# EAGLE schematic mapleCUx_med_022 (EAGLE 7.3.0)
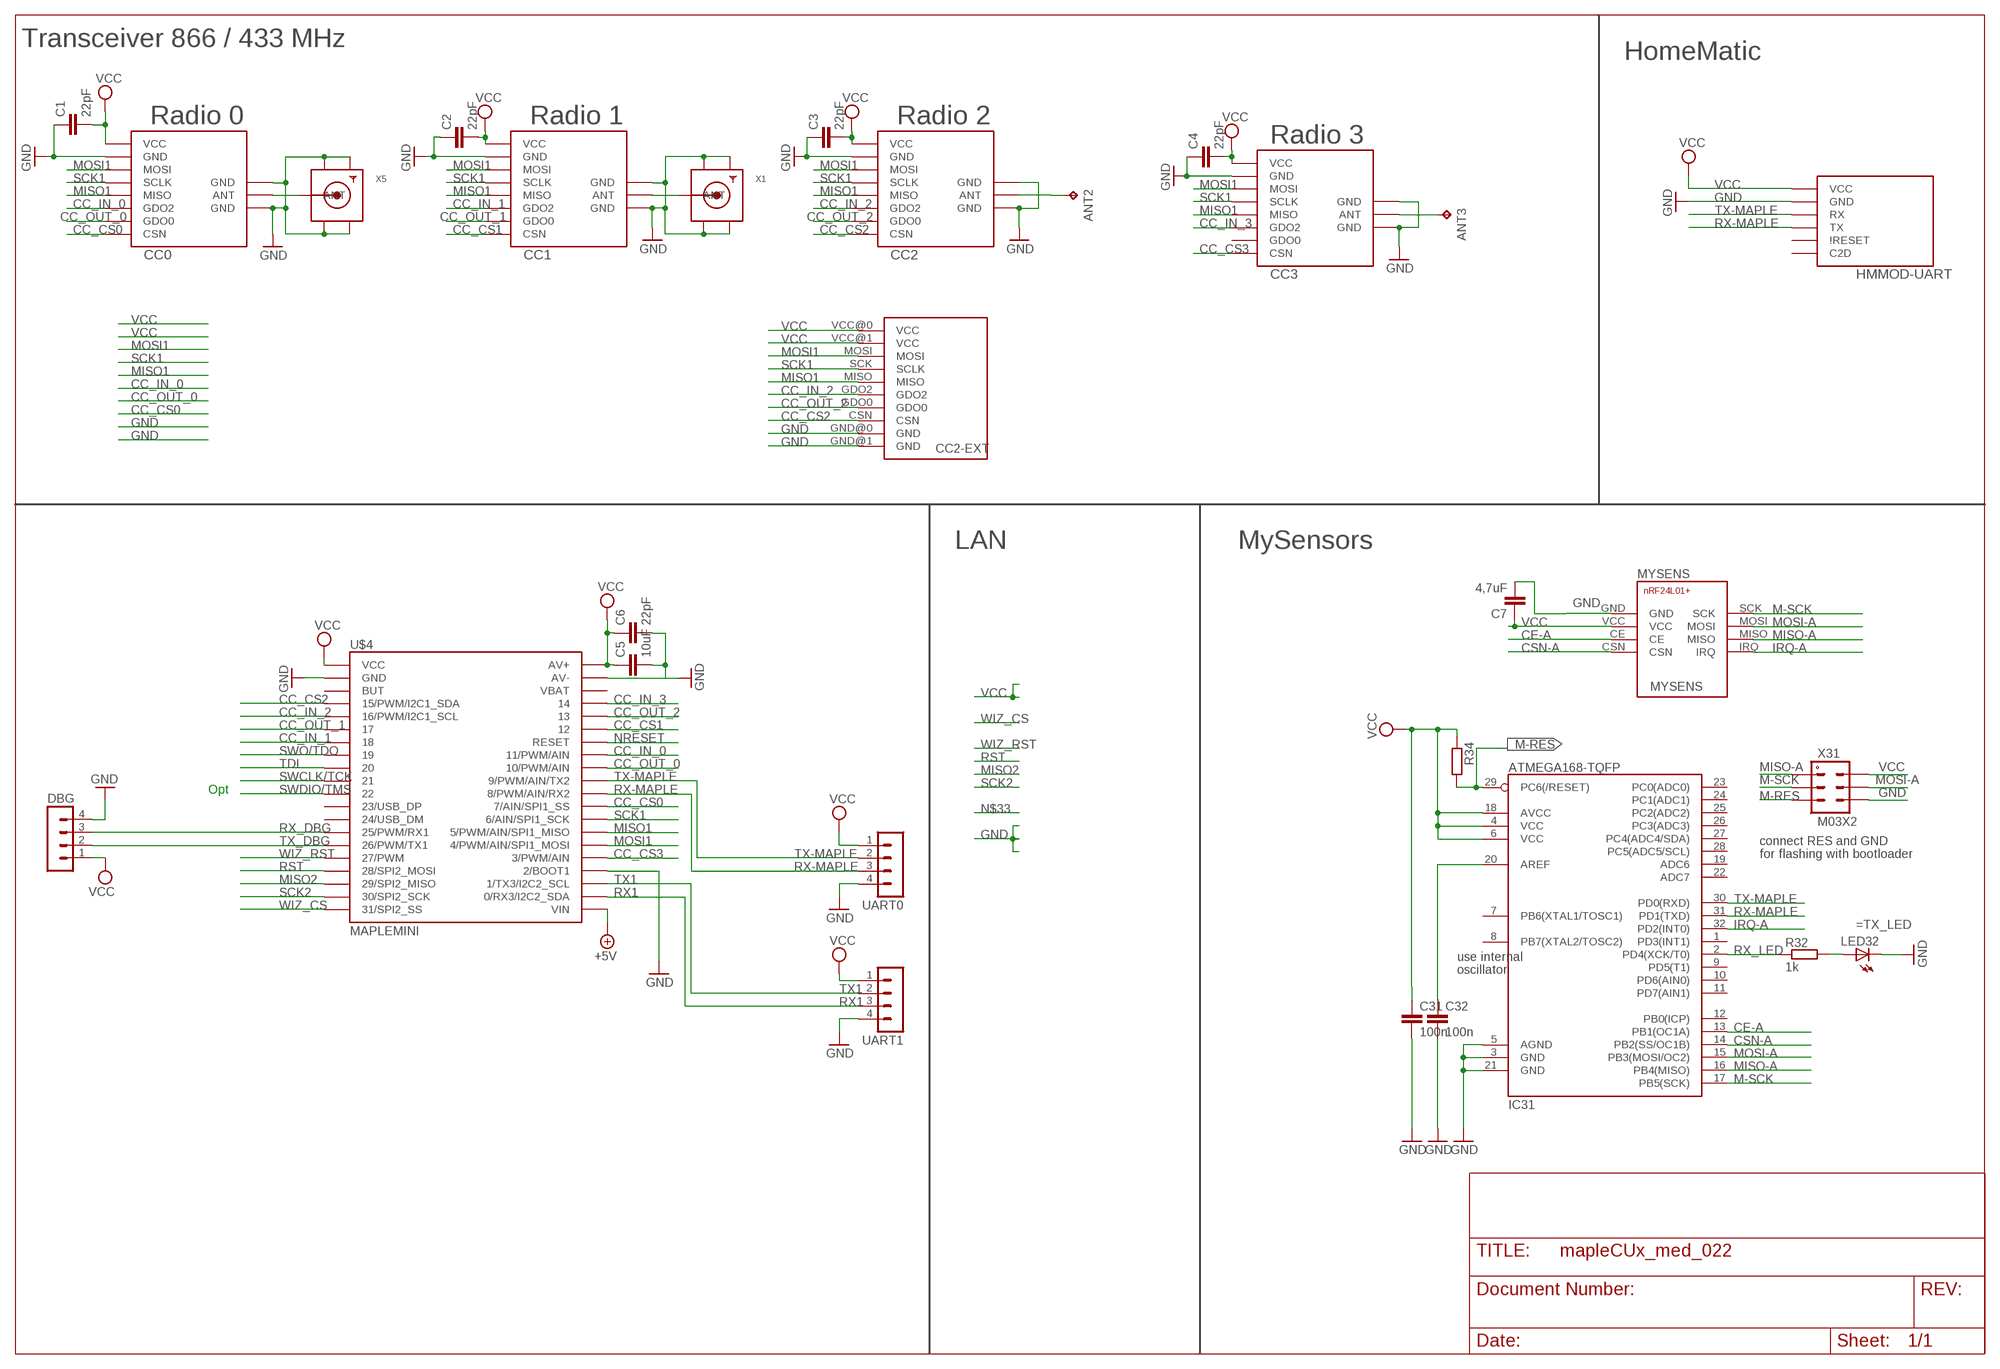
[diagram p0: schematic, sheet 1]

## Parts
ANT2  TPPAD1-13  [P1-13]
ANT3  TPPAD1-13  [P1-13]
C1  22pF  C-EUC0805  [C0805]
C2  22pF  C-EUC0805  [C0805]
C3  22pF  C-EUC0805  [C0805]
C4  22pF  C-EUC0805  [C0805]
C5  10uF  C-EUC1210  [C1210]
C6  22pF  C-EUC0805  [C0805]
C7  4,7uF  C-EUC1210  [C1210]
C31  100n  C-EUC0805  [C0805]
C32  100n  C-EUC0805  [C0805]
CC0  CC1101  CC1101_MODULE1SMD  [CC1101_MODULE1_SMD]
CC1  CC1101_MODULE1SMD  [CC1101_MODULE1_SMD]
CC2  CC1101_MODULE1SMD  [CC1101_MODULE1_SMD]
CC2-EXT  CC1101_MODULE3_DIL  [CC1101_MODULE3_DIL]
CC3  CC1101_MODULE1SMD  [CC1101_MODULE1_SMD]
DBG  MA04-1  [MA04-1]
HMMOD-UART  HM-MOD-UARTDIL  [HM-MOD-UART-DIL]
IC31  ATMEGA168-TQFP  [TQFP32-08]
LED32  LEDCHIPLED_0805  [CHIPLED_0805]
MYSENS  NRF24L01+SMD  [NRF24L01+SMD]
R32  1k  R-EU_R0805  [R0805]
R34  R-EU_R0805  [R0805]
U$4  MAPLEMINI  [20-DIP]
UART0  MA04-1  [MA04-1]
UART1  MA04-1  [MA04-1]
X1  SMACONNECTOR_EDGE_UFL  [SMA_EDGELAUNCH_UFL]
X5  SMACONNECTOR_EDGE_UFL  [SMA_EDGELAUNCH_UFL]
X31  M03X2  [2X03-1.27MM_SMD]

## Nets
+5V: U$4.21(VIN)
CC_CS0: CC0.CSN U$4.29(7/AIN/SPI1_SS)
CC_CS1: CC1.CSN U$4.35
CC_CS2: CC2-EXT.CSN CC2.CSN U$4.4(15/PWM/I2C1_SDA)
CC_CS3: CC3.CSN U$4.25(3/PWM/AIN)
CC_IN_0: CC0.GDO2 U$4.33(11/PWM/AIN)
CC_IN_1: CC1.GDO2 U$4.7
CC_IN_2: CC2-EXT.GDO2 CC2.GDO2 U$4.5(16/PWM/I2C1_SCL)
CC_IN_3: CC3.GDO2 U$4.37
CC_OUT_0: CC0.GDO0 U$4.32(10/PWM/AIN)
CC_OUT_1: CC1.GDO0 U$4.6
CC_OUT_2: CC2-EXT.GDO0 CC2.GDO0 U$4.36
CE-A: IC31.13(PB1(OC1A)) MYSENS.CE
CSN-A: IC31.14(PB2(SS/OC1B)) MYSENS.CSN
GND [PWR]: C1.1 C2.1 C3.1 C4.1 C5.2 C6.2 C7.2 C31.2 C32.2 CC0.GND@0(GND) CC0.GND@1(GND) CC0.GND@2(GND) CC1.GND@0(GND) CC1.GND@1(GND) CC1.GND@2(GND) CC2-EXT.GND@0(GND) CC2-EXT.GND@1(GND) CC2.GND@0(GND) CC2.GND@1(GND) CC2.GND@2(GND) CC3.GND@0(GND) CC3.GND@1(GND) CC3.GND@2(GND) DBG.4 HMMOD-UART.2(GND) IC31.3(GND) IC31.5(AGND) IC31.21(GND) LED32.C MYSENS.GND U$4.2(GND) U$4.24(2/BOOT1) U$4.39(AV-) UART0.4 UART1.4 X1.GND@1(GND1) X1.GND@2(GND2) X1.GND@3(GND3) X1.GND@4(GND4) X5.GND@1(GND1) X5.GND@2(GND2) X5.GND@3(GND3) X5.GND@4(GND4) X31.P$6
IRQ-A: IC31.32(PD2(INT0)) MYSENS.IRQ
M-RES: IC31.29(PC6(/RESET)) R34.2 X31.P$5
M-SCK: IC31.17(PB5(SCK)) MYSENS.SCK X31.P$3
MISO1: CC0.MISO CC1.MISO CC2-EXT.MISO CC2.MISO CC3.MISO U$4.27(5/PWM/AIN/SPI1_MISO)
MISO2: U$4.18(29/SPI2_MISO)
MISO-A: IC31.16(PB4(MISO)) MYSENS.MISO X31.P$1
MOSI1: CC0.MOSI CC1.MOSI CC2-EXT.MOSI CC2.MOSI CC3.MOSI U$4.26(4/PWM/AIN/SPI1_MOSI)
MOSI-A: IC31.15(PB3(MOSI/OC2)) MYSENS.MOSI X31.P$4
N$1: CC1.ANT X1.P(ANT)
N$2: ANT3.TP CC3.ANT
N$3: ANT2.TP CC2.ANT
N$4: CC0.ANT X5.P(ANT)
N$5: LED32.A R32.2
N$15: C32.1 IC31.20(AREF)
NRESET: U$4.34(RESET)
RST: U$4.17(28/SPI2_MOSI)
RX1: U$4.22(0/RX3/I2C2_SDA) UART1.3
RX-MAPLE: HMMOD-UART.5(TX) IC31.31(PD1(TXD)) U$4.30(8/PWM/AIN/RX2) UART0.3
RX_DBG: DBG.3 U$4.14(25/PWM/RX1)
RX_LED: IC31.2(PD4(XCK/T0)) R32.1
SCK1: CC0.SCLK CC1.SCLK CC2-EXT.SCK(SCLK) CC2.SCLK CC3.SCLK U$4.28(6/AIN/SPI1_SCK)
SCK2: U$4.19(30/SPI2_SCK)
SWCLK/TCK: U$4.10
SWDIO/TMS: U$4.11
SWO/TDO: U$4.8
TDI: U$4.9
TX1: U$4.23(1/TX3/I2C2_SCL) UART1.2
TX-MAPLE: HMMOD-UART.6(RX) IC31.30(PD0(RXD)) U$4.31(9/PWM/AIN/TX2) UART0.2
TX_DBG: DBG.2 U$4.15(26/PWM/TX1)
VCC [PWR]: C1.2 C2.2 C3.2 C4.2 C5.1 C6.1 C7.1 C31.1 CC0.VCC CC1.VCC CC2-EXT.VCC@0(VCC) CC2-EXT.VCC@1(VCC) CC2.VCC CC3.VCC DBG.1 HMMOD-UART.1(VCC) IC31.4(VCC) IC31.6(VCC) IC31.18(AVCC) MYSENS.VCC R34.1 U$4.1(VCC) U$4.40(AV+) UART0.1 UART1.1 X31.P$2
WIZ_CS: U$4.20(31/SPI2_SS)
WIZ_RST: U$4.16(27/PWM)
Unconnected: CC3.GDO0 HMMOD-UART.3(C2D) HMMOD-UART.4(\!RESET) IC31.1(PD3(INT1)) IC31.7(PB6(XTAL1/TOSC1)) IC31.8(PB7(XTAL2/TOSC2)) IC31.9(PD5(T1)) IC31.10(PD6(AIN0)) IC31.11(PD7(AIN1)) IC31.12(PB0(ICP)) IC31.19(ADC6) IC31.22(ADC7) IC31.23(PC0(ADC0)) IC31.24(PC1(ADC1)) IC31.25(PC2(ADC2)) IC31.26(PC3(ADC3)) IC31.27(PC4(ADC4/SDA)) IC31.28(PC5(ADC5/SCL)) U$4.3(BUT) U$4.12(23/USB_DP) U$4.13(24/USB_DM) U$4.38(VBAT)

## Notes on the sheet
- Transceiver 866 / 433 MHz
- HomeMatic
- Radio 0 | Radio 1 | Radio 2
- Radio 3
- LAN | MySensors
- Opt
- connect RES and GND
- for flashing with bootloader
- =TX_LED
- use internal
- oscillator

## Library data of the parts
ANT2 ANT3 = testpad:TP: Test pad
C1-C7 C31 C32 = rcl:C-EU: CAPACITOR, European symbol
CC0 CC1-CC3 = wireless:CC1101_MODULE1: CC1101 wireless module for 433/868 MHz (sold from Aliexpress). DIL version for mounting with pin header (and SMD soldering) and SMD only variant available.
CC2-EXT = wireless:CC1101_MODULE3_DIL: 433 Mhz CC1101 wireless module named RF1101SE V3.1 package special has only limited silk screen on tPlace layer
DBG UART0 UART1 = con-lstb:MA04-1: PIN HEADER; OC_FARNELL: unknown; OC_NEWARK: unknown
HMMOD-UART = wireless:HM-MOD-UART: eQ3 HM-MOD-UART-AW-SH2 wireless module for 868 MHz. DIL version for mounting with pin header (antenna upwards) and SMD variant available (antenna downwards).
IC31 = atmel:ATMEGA168: Atmel Atmega 168/328/328P
LED32 = led:LED: LED OSRAM: - CHIPLED LG R971, LG N971, LY N971, LG Q971, LY Q971, LO R971, LY R971 LH N974, LH R974 LS Q976, LO Q976, LY Q976 LO Q996 - Hyper CHIPLED LW Q18S LB Q993, LB Q99A, LB R99A - SideLED LS A670, LO A670, LY A670, LG A670, LP A670 LB A673, LV A673, LT A673, LW A673 LH A674 LY A675 LS A676, LA A676, LO A676, LY A676, LW A676 LS A679, LY A679, LG A679 - Hyper Micro SIDELED® LS Y876, LA Y876, LO Y876, LY Y876 LT Y87S - SmartLED LW L88C, LW L88S LB L89C, LB L89S, LG L890 LS L89K, LO L89K, LY L89K LS L896, LA L896, LO L896, LY L896 - TOPLED LS T670, LO T670, LY T670, LG T670, LP T670 LSG T670, LSP T670, LSY T670, LOP T670, LYG T670 LG T671, LOG T671, LSG T671 LB T673, LV T673, LT T673, LW T673 LH T674 LS T676, LA T676, LO T676, LY T676, LB T676, LH T676, LSB T676, LW T676 LB T67C, LV T67C, LT T67C, LS T67K, LO T67K, LY T67K, LW E67C LS E67B, LA E67B, LO E67B, LY E67B, LB E67C, LV E67C, LT E67C LW T67C LS T679, LY T679, LG T679 LS T770, LO T770, LY T770, LG T770, LP T770 LB T773, LV T773, LT T773, LW T773 LH T774 LS E675, LA E675, LY E675, LS T675 LS T776, LA T776, LO T776, LY T776, LB T776 LHGB T686 LT T68C, LB T68C - Hyper Mini TOPLED® LB M676 - Mini TOPLED Santana® LG M470 LS M47K, LO M47K, LY M47K Source: http://www.osram.convergy.de LUXEON: - LUMILED® LXK2-PW12-R00, LXK2-PW12-S00, LXK2-PW14-U00, LXK2-PW14-V00 LXK2-PM12-R00, LXK2-PM12-S00, LXK2-PM14-U00 LXK2-PE12-Q00, LXK2-PE12-R00, LXK2-PE12-S00, LXK2-PE14-T00, LXK2-PE14-U00 LXK2-PB12-K00, LXK2-PB12-L00, LXK2-PB12-M00, LXK2-PB14-N00, LXK2-PB14-P00, LXK2-PB14-Q00 LXK2-PR12-L00, LXK2-PR12-M00, LXK2-PR14-Q00, LXK2-PR14-R00 LXK2-PD12-Q00, LXK2-PD12-R00, LXK2-PD12-S00 LXK2-PH12-R00, LXK2-PH12-S00 LXK2-PL12-P00, LXK2-PL12-Q00, LXK2-PL12-R00 Source: www.luxeon.com KINGBRIGHT: KA-3528ASYC Source: www.kingbright.com
MYSENS = wireless:NRF24L01+: nRF24L01+ Transceiver Module
R32 R34 = rcl:R-EU_: RESISTOR, European symbol
U$4 = maplemini-mall:MAPLEMINI
X1 X5 = adafruit:SMACONNECTOR: SMA Connector 90° DIP SMA Connector, 50 Ohm (4UConnector: 07259)
X31 = mechanics:M03X2

## Net classes
0 default: width 0.305 mm
1 PWR: width 0.457 mm